# EAGLE design TestResitorArraySmd (EAGLE 7.6.0)
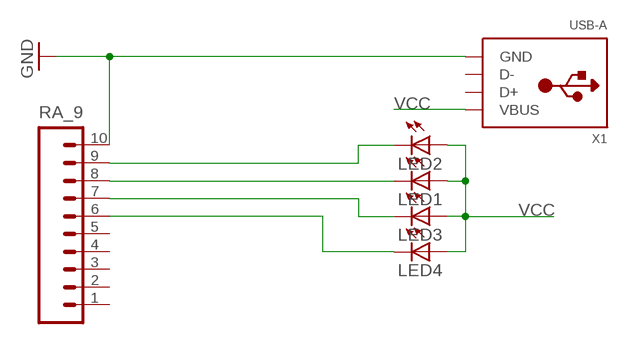
[diagram p0: schematic, sheet 1]

## Parts
LED1  LEDSMT1206  [1206]
LED2  LEDSMT1206  [1206]
LED3  LEDSMT1206  [1206]
LED4  LEDSMT1206  [1206]
RA_9  M10SMD_MALE  [1X10_SMD_MALE]
X1  USB-A  [MOLEX_480371000]

## Nets
GND: RA_9.10 X1.4(GND)
N$1: LED2.C RA_9.9
N$2: LED1.C RA_9.8
N$3: LED3.C RA_9.7
N$4: LED4.C RA_9.6
VCC: LED1.A LED2.A LED3.A LED4.A X1.1(VBUS)
Unconnected: RA_9.1 RA_9.2 RA_9.3 RA_9.4 RA_9.5 X1.2(D-) X1.3(D+)

## Library data of the parts
LED1-LED4 = adafruit:LED: LED OSRAM: - CHIPLED LG R971, LG N971, LY N971, LG Q971, LY Q971, LO R971, LY R971 LH N974, LH R974 LS Q976, LO Q976, LY Q976 LO Q996 - Hyper CHIPLED LW Q18S LB Q993, LB Q99A, LB R99A - SideLED LS A670, LO A670, LY A670, LG A670, LP A670 LB A673, LV A673, LT A673, LW A673 LH A674 LY A675 LS A676, LA A676, LO A676, LY A676, LW A676 LS A679, LY A679, LG A679 - Hyper Micro SIDELED® LS Y876, LA Y876, LO Y876, LY Y876 LT Y87S - SmartLED LW L88C, LW L88S LB L89C, LB L89S, LG L890 LS L89K, LO L89K, LY L89K LS L896, LA L896, LO L896, LY L896 - TOPLED LS T670, LO T670, LY T670, LG T670, LP T670 LSG T670, LSP T670, LSY T670, LOP T670, LYG T670 LG T671, LOG T671, LSG T671 LB T673, LV T673, LT T673, LW T673 LH T674 LS T676, LA T676, LO T676, LY T676, LB T676, LH T676, LSB T676, LW T676 LB T67C, LV T67C, LT T67C, LS T67K, LO T67K, LY T67K, LW E67C LS E67B, LA E67B, LO E67B, LY E67B, LB E67C, LV E67C, LT E67C LW T67C LS T679, LY T679, LG T679 LS T770, LO T770, LY T770, LG T770, LP T770 LB T773, LV T773, LT T773, LW T773 LH T774 LS E675, LA E675, LY E675, LS T675 LS T776, LA T776, LO T776, LY T776, LB T776 LHGB T686 LT T68C, LB T68C - Hyper Mini TOPLED® LB M676 - Mini TOPLED Santana® LG M470 LS M47K, LO M47K, LY M47K Source: http://www.osram.convergy.de/
RA_9 = SparkFun-Connectors:M10: Header 10 Standard 10-pin 0.1" header. Use with straight break away headers (SKU : PRT-00116), right angle break away headers (PRT-00553), swiss pins (PRT-00743), machine pins (PRT-00117), and female headers (PRT-00115).; PROD_ID: CONN-11291
X1 = adafruit:USB-A: USB type A 'plug' Used for things that can directly connect to a USB port, say USB key

## Board
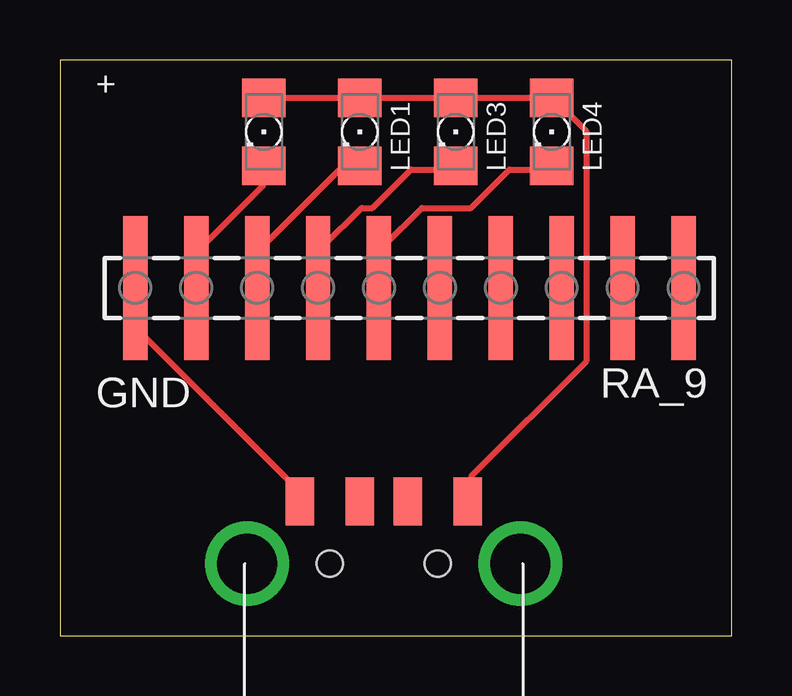
[diagram p1: board, top side]

Size 28 x 24 mm. Coordinates in mm from the lower left corner, seen from the top.
Outline: 0,0 28,0 28,24 0,24 0,0
Copper layers (1*16): Top 0.035mm / dielectric 1.5mm / Bottom 0.035mm
Design rules "default": minimum track width 10mil, minimum drill 24mil, track to track 8mil, track to pad 8mil, pad to pad 8mil, via to via 8mil, smd to smd 8mil, copper to edge 40mil, drill to drill 8mil, minimum pad ring 10mil, minimum via ring 8mil, stop-mask expansion 4mil, vias tented up to drill 0mil, thermal gap 10mil

### Footprints (pad centres in the part's own frame; a part is rotated, then mirrored left to right if it is on the bottom)
1206 = smd 1.6 x 1.803: A -1.422,0; C 1.422,0
1X10_SMD_MALE = smd 1.02 x 6: 1 0,0; 2 2.54,0; 3 5.08,0; 4 7.62,0; 5 10.16,0; 6 12.7,0; 7 15.24,0; 8 17.78,0; 9 20.32,0; 10 22.86,0
MOLEX_480371000 = smd 1.2 x 2: 1 3.5,2.6; 2 1,2.6; 3 -1,2.6; 4 -3.5,2.6 | drill 2.5: M1 -5.7,0; M2 5.7,0 | hole 1.1: -2.25,0; 2.25,0

### Placement (x,y rotation side)
LED1  12.5,21 270 top
LED2  8.5,21 270 top
LED3  16.5,21 270 top
LED4  20.5,21 270 top
RA_9  26,14.5 180 top
X1  13.5,3 0 top

### Tracks (layer width: path | path; a pad name or v marks a point on that pad's centre or on a via)
GND
  Top 0.254: X1.4 9.83,5.71 9.83,6.17 3.2,12.8 3.2,14.4 RA_9.10
N$1
  Top 0.254: LED2.C 8.46,19.43 8.46,18.75 5.71,16 5.71,14.63 RA_9.9
N$2
  Top 0.254: LED1.C 12.34,19.43 11.66,19.43 8.23,16 8.23,14.63 RA_9.8
N$3
  Top 0.254: LED3.C 16.46,19.43 14.63,19.43 13.03,17.83 12.57,17.83 10.97,16.23 10.97,14.63 RA_9.7
N$4
  Top 0.254: LED4.C 20.34,19.43 18.75,19.43 17.14,17.83 15.09,17.83 13.49,16.23 13.49,14.63 RA_9.6
VCC
  Top 0.254: LED2.A 8.69,22.4 12.34,22.4 LED1.A 12.57,22.4 16.46,22.4 LED3.A 16.69,22.4 20.34,22.4 LED4.A 20.57,22.4 21.95,21.03 21.95,11.43 17.14,6.63 17.14,5.71 X1.1

### Text on the board
tNames: + | GND